# EAGLE design MUTEBRD (EAGLE 5.07)
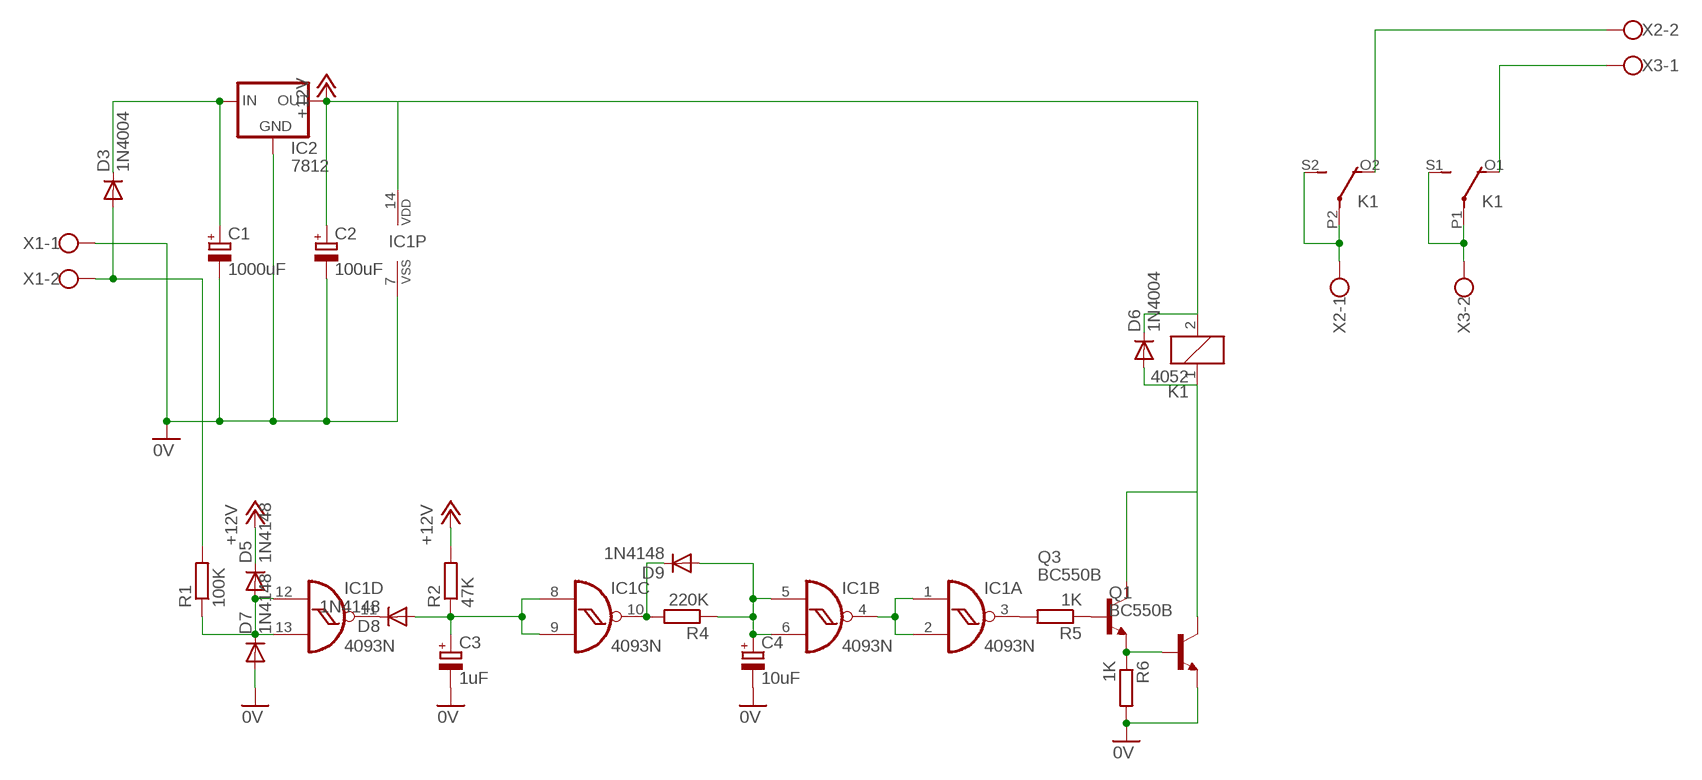
[diagram p0: schematic, sheet 1]

## Parts
C1  1000uF  CPOL-EUE7.5-16  [E7,5-16]
C2  100uF  CPOL-EUTAP5-70  [TAP5-70]
C3  1uF  CPOL-EUE2,5-6E  [E2,5-6E]
C4  10uF  CPOL-EUE2.5-6  [E2,5-6]
D3  1N4004  [DO41-10]
D5  1N4148  1N4148DO35-10  [DO35-10]
D6  1N4004  [DO41-10]
D7  1N4148  1N4148DO35-10  [DO35-10]
D8  1N4148  1N4148DO35-10  [DO35-10]
D9  1N4148  1N4148DO35-10  [DO35-10]
IC1  4093N  [DIL14]
IC2  7812  78XXL  [78XXL]
K1  4052  [F4052]
Q1  BC550B  [TO92-EBC]
Q3  BC550B  [TO92-EBC]
R1  100K  R-EU_0204/7  [0204/7]
R2  47K  R-EU_0204/7  [0204/7]
R4  220K  R-EU_0207/10  [0207/10]
R5  1K  R-EU_0204/7  [0204/7]
R6  1K  R-EU_0204/7  [0204/7]
X1  W237-102  [W237-102]
X2  W237-102  [W237-102]
X3  W237-102  [W237-102]

## Nets
0V: C1.- C2.- C3.- C4.- D7.A IC1.7(P:VSS) IC2.GND Q1.E R6.2 X1.1
+12V: C2.+ D5.C D6.C IC1.14(P:VDD) IC2.OUT K1.2 R2.2
N$1: D3.A R1.2 X1.2
N$2: C1.+ D3.C IC2.IN
N$3: D8.C IC1.11(D:O)
N$4: D6.A K1.1 Q1.C Q3.C
N$6: D5.A D7.C IC1.12(D:I0) IC1.13(D:I1) R1.1
N$7: C3.+ D8.A IC1.8(C:I0) IC1.9(C:I1) R2.1
N$8: D9.C IC1.10(C:O) R4.2
N$9: IC1.3(A:O) R5.2
N$10: IC1.1(A:I0) IC1.2(A:I1) IC1.4(B:O)
N$11: C4.+ D9.A IC1.5(B:I0) IC1.6(B:I1) R4.1
N$13: Q3.B R5.1
N$14: Q1.B Q3.E R6.1
N$16: K1.P2(3:P) K1.S2(3:S) X2.1
N$17: K1.O2(3:O) X2.2
N$18: K1.O1(2:O) X3.1
N$19: K1.P1(2:P) K1.S1(2:S) X3.2

## Library data of the parts
C1-C4 = resistor:CPOL-EU: POLARIZED CAPACITOR, European symbol
D3 D6 = diode:1N4004: DIODE general purpose rectifier, 1 A
D5 D7-D9 = diode:1N4148: DIODE high speed (Philips)
IC1 = 40xx:4093: Quad 2-input NAND schmitt trigger
IC2 = v-reg:78XXL: VOLTAGE REGULATOR
K1 = relay:4052: RELAY 2 x switch, Finder
Q1 Q3 = transistor-npn:BC550*: NPN Transistor
R1 R2 R4-R6 = resistor:R-EU_: RESISTOR, European symbol
X1-X3 = con-wago-500:W237-102: WAGO SCREW CLAMP

## Board
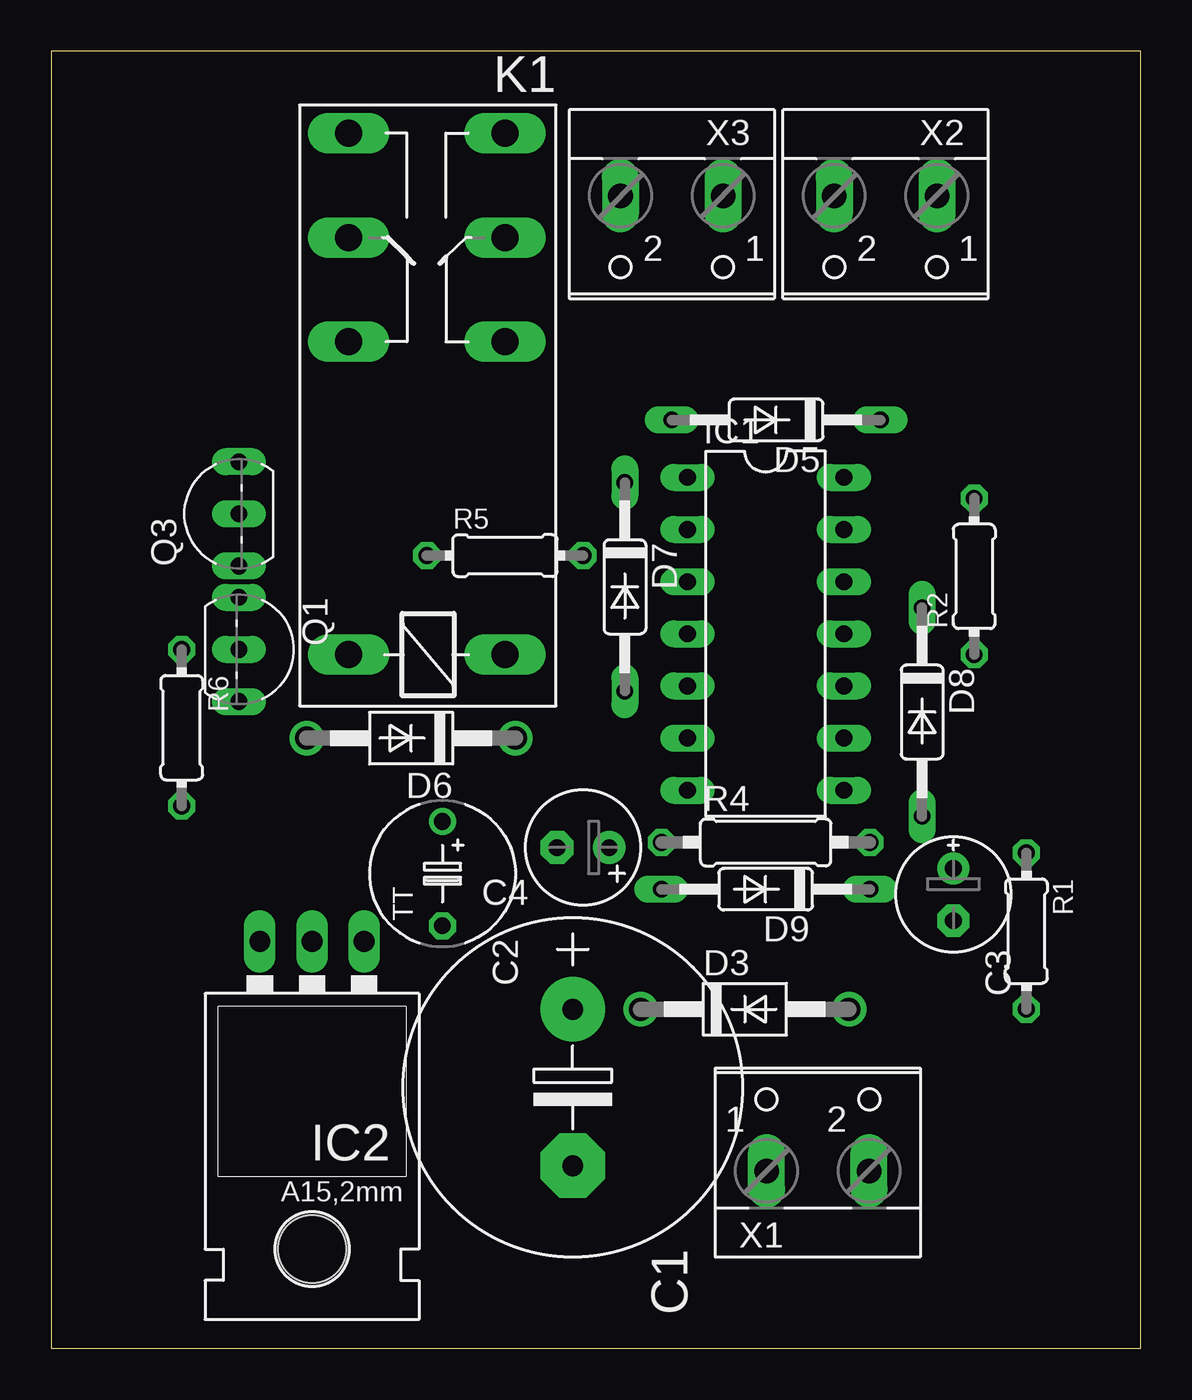
[diagram p1: board, top side]
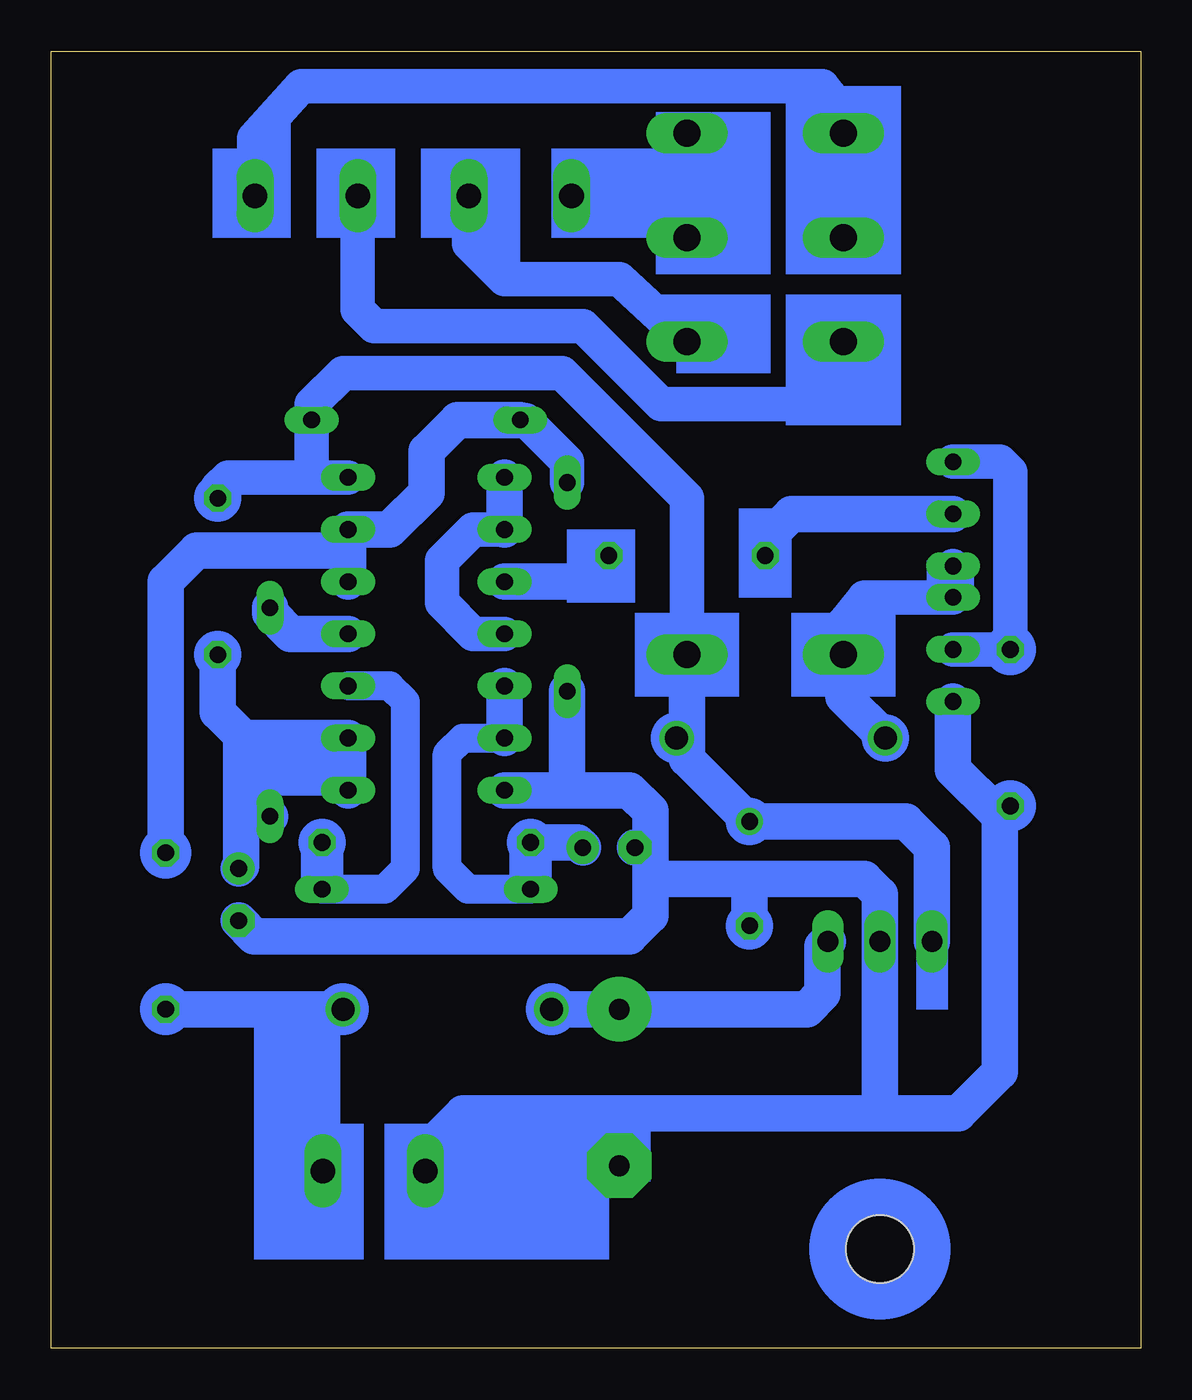
[diagram p2: board, bottom side, seen from below]

Size 53.07 x 63.17 mm. Coordinates in mm from the lower left corner, seen from the top.
Outline: 0,0 53.07,0 53.07,63.17 0,63.17 0,0
Copper layers (1*16): Top 0.035mm / dielectric 1.5mm / Bottom 0.035mm
Design rules "default": minimum track width 10mil, minimum drill 24mil, track to track 8mil, track to pad 8mil, pad to pad 8mil, via to via 8mil, smd to smd 8mil, copper to edge 40mil, drill to drill 8mil, minimum pad ring 10mil, minimum via ring 8mil, stop-mask expansion 4mil, vias tented up to drill 0mil, thermal gap 10mil

### Footprints (pad centres in the part's own frame; a part is rotated, then mirrored left to right if it is on the bottom)
E7,5-16 = drill 1.016 pad 3.15 round: + -3.81,0 | drill 1.016 pad 3.15 octagon: - 3.81,0
TAP5-70 = drill 0.813 round: + -2.54,0 | drill 0.813 octagon: - 2.54,0
E2,5-6E = drill 0.813 pad 1.575 round: + -1.27,0 | drill 0.813 pad 1.575 octagon: - 1.27,0
E2,5-6 = drill 0.813 pad 1.6 round: + -1.27,0 | drill 0.813 pad 1.6 octagon: - 1.27,0
DO41-10 = drill 1.118 round: A 5.08,0; C -5.08,0
DO35-10 = drill 0.813 long: A 5.08,0; C -5.08,0
DIL14 = drill 0.813 long: 1 -7.62,-3.81; 2 -5.08,-3.81; 3 -2.54,-3.81; 4 0,-3.81; 5 2.54,-3.81; 6 5.08,-3.81; 7 7.62,-3.81; 8 7.62,3.81; 9 5.08,3.81; 10 2.54,3.81; 11 0,3.81; 12 -2.54,3.81; 13 -5.08,3.81; 14 -7.62,3.81
78XXL = drill 1.016 long: GND 0,-3.81; IN -2.54,-3.81; OUT 2.54,-3.81 | hole 3.302: 0,11.176
F4052 = drill 1.321 long: 1 -3.81,3.81; 2 -3.81,-3.81; O1 11.43,-3.81; O2 11.43,3.81; P1 16.51,-3.81; P2 16.51,3.81; S1 21.59,-3.81; S2 21.59,3.81
TO92-EBC = drill 0.813 long: B 0,-1.27; C -2.54,-1.27; E 2.54,-1.27
0204/7 = drill 0.813 octagon: 1 -3.81,0; 2 3.81,0
0207/10 = drill 0.813 octagon: 1 -5.08,0; 2 5.08,0
W237-102 = drill 1.194 long: 1 -2.5,-1.27; 2 2.5,-1.27

### Placement (x,y rotation side)
C1  25.4,12.7 270 top
C2  19.05,23.11 270 top
C3  43.94,22.1 270 top
C4  25.91,24.38 180 top
D3  33.78,16.51 0 top
D5  35.31,45.21 180 top
D6  17.53,29.72 180 top
D7  27.94,37.08 270 top
D8  42.42,30.99 270 top
D9  34.8,22.35 180 top
IC1  34.8,34.8 270 top
IC2  12.7,16 180 top
K1  18.29,37.59 90 top
Q1  10.41,34.04 270 top
Q3  7.87,40.64 90 top
R1  47.5,20.32 270 top
R2  44.96,37.59 90 top
R4  34.8,24.64 0 top
R5  22.1,38.61 0 top
R6  6.35,30.23 270 top
X1  37.34,9.91 0 top
X2  40.64,54.86 180 top
X3  30.23,54.86 180 top

### Tracks (layer width: path | path; a pad name or v marks a point on that pad's centre or on a via)
0V
  Bottom 1.676: 6.86,25.91 6.98,26.03 6.73,26.03 R6.2
  Bottom 1.778: 12.7,11.43 IC2.GND 12.7,22.1 13.46,22.86 19.05,22.86 | 12.7,11.43 25.4,11.43 | 23.88,24.38 23.88,26.16 24.89,27.18 27.94,27.18 | 27.94,27.18 IC1.7 | 23.88,24.38 C4.- | 27.94,27.18 D7.A | C3.- 43.18,20.07 24.89,20.07 23.88,21.08 23.88,22.86 | 23.88,22.86 23.88,24.38 | 19.05,22.86 23.88,22.86 | 19.05,22.86 C2.- | 12.7,11.43 8.89,11.43 6.86,13.46 6.86,25.91 | Q1.E 9.14,28.19 6.98,26.03 | 25.4,11.43 C1.- | X1.1 34.8,7.91 34.8,9.65 33.02,11.43 25.4,11.43
+12V
  Bottom 1.676: K1.2 22.1,41.4 28.19,47.5 38.86,47.5 40.39,45.97 D5.C 40.39,42.42 | 40.39,42.42 IC1.14 | R2.2 44.96,41.91 44.45,42.42 40.39,42.42
  Bottom 1.778: IC2.OUT 10.16,24.38 11.43,25.65 C2.+ 22.1,28.7 22.1,29.97 | 22.1,29.97 K1.2 | D6.C 22.35,29.97 22.1,29.97
N$1
  Bottom 1.778: X1.2 39.88,8.68 39.88,16.51 D3.A R1.2
N$2
  Bottom 1.778: IC2.IN 15.49,19.56 15.49,17.27 16.26,16.51 C1.+ D3.C
N$3
  Bottom 1.778: IC1.11 41.4,34.8 42.42,35.81 D8.C
N$4
  Bottom 1.676: Q3.C Q1.C 13.46,36.58 14.48,35.31 K1.1
  Bottom 1.778: D6.A 14.48,31.75 K1.1
N$6
  Bottom 1.676: D7.C 27.94,43.18 29.97,45.21 D5.A
  Bottom 1.778: 38.61,38.86 IC1.13 36.58,39.88 34.8,41.66 34.8,43.69 33.27,45.21 D5.A | 38.61,38.86 IC1.12 | 38.61,38.86 45.97,38.86 47.5,37.34 R1.1
N$7
  Bottom 1.778: IC1.8 IC1.9 43.69,29.72 43.81,29.84 | R2.1 44.96,30.99 43.81,29.84 | C3.+ 43.81,23.49 43.81,25.91 | 43.81,29.84 43.81,25.91 | 43.81,25.91 D8.A
N$8
  Bottom 1.422: IC1.10 36.58,32.26 35.81,31.5 35.81,23.37 36.83,22.35 D9.C R4.2
N$9
  Bottom 1.778: IC1.3 27.18,37.34 R5.2
N$10
  Bottom 1.676: IC1.2 32.51,39.88 34.04,38.35 34.04,36.32 32.51,34.8 IC1.4
  Bottom 1.778: IC1.2 IC1.1
N$11
  Bottom 1.422: IC1.6 33.02,29.72 33.78,28.96 33.78,23.37 32.77,22.35 D9.A R4.1
  Bottom 1.778: IC1.6 IC1.5 | C4.+ 27.43,24.64 R4.1
N$13
  Bottom 1.778: Q3.B 17.02,40.64 18.29,39.37 R5.1
N$14
  Bottom 1.676: Q1.B R6.1 6.35,42.67 6.86,43.18 Q3.E
N$16
  Bottom 1.676: X2.1 43.18,56.17 43.18,58.93 40.89,61.47 15.49,61.47 14.48,60.2 K1.S2
  Bottom 1.778: K1.P2 K1.S2
N$17
  Bottom 1.676: 14.99,48.77 14.48,48.26 14.48,47.24 15.75,45.97 23.37,45.97 27.18,49.78 37.34,49.78 38.14,50.59 X2.2
  Bottom 1.778: K1.O2 14.99,48.77
N$18
  Bottom 1.676: K1.O1 25.4,52.07 30.99,52.07 32.73,53.81 X3.1
N$19
  Bottom 1.676: 22.1,56.13 X3.2
  Bottom 1.778: K1.P1 22.1,56.13 K1.S1
(copper drawn outside any net)
  shapes: Bottom area x31, Bottom circle x15